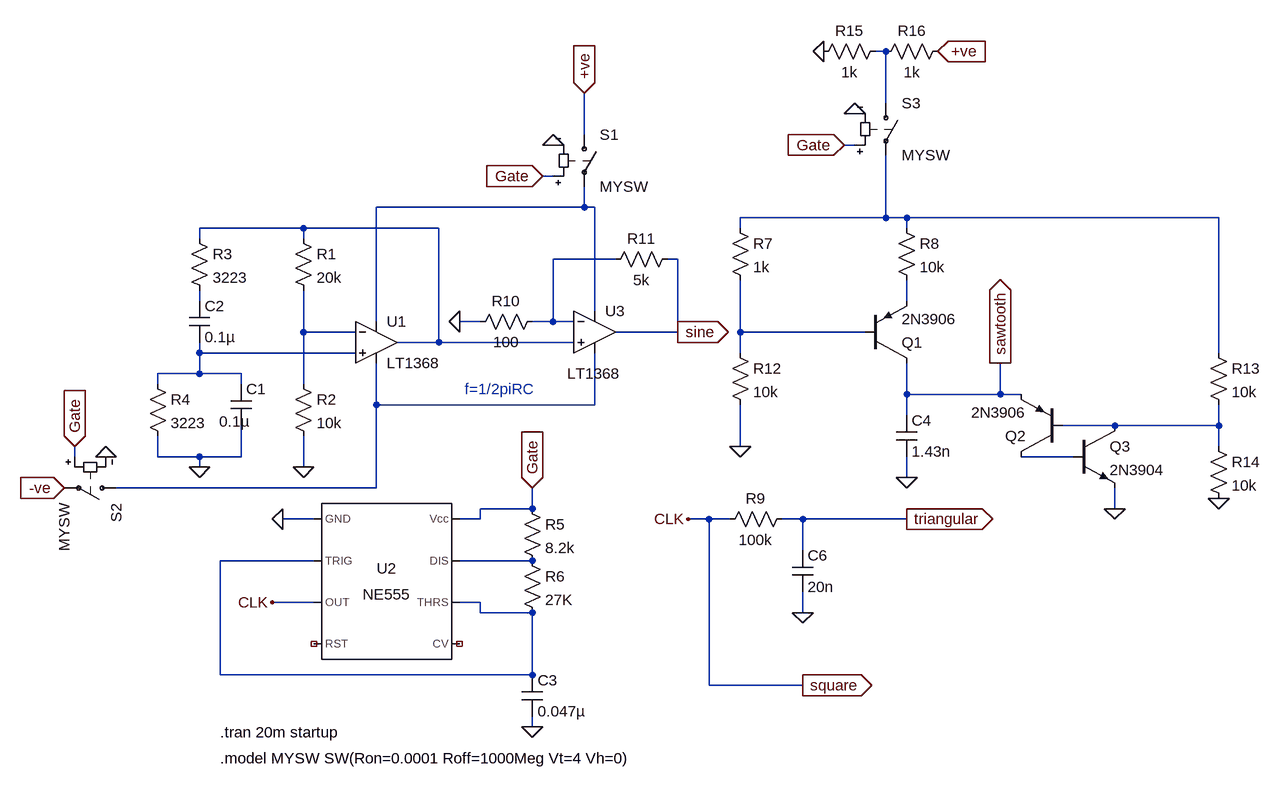
[diagram p0: schematic si.asc]
si.asc, the LTspice schematic file:
Version 4
SHEET 1 1908 792
WIRE 1328 -400 1312 -400
WIRE 1328 -320 1328 -400
WIRE 864 -272 864 -336
WIRE 1280 -256 1264 -256
WIRE 816 -208 800 -208
WIRE 864 -160 864 -192
WIRE 864 -160 544 -160
WIRE 880 -160 864 -160
WIRE 1328 -144 1328 -240
WIRE 1328 -144 1104 -144
WIRE 1360 -144 1328 -144
WIRE 1840 -144 1360 -144
WIRE 432 -128 272 -128
WIRE 640 -128 432 -128
WIRE 1104 -128 1104 -144
WIRE 1360 -128 1360 -144
WIRE 272 -112 272 -128
WIRE 432 -112 432 -128
WIRE 912 -80 816 -80
WIRE 1008 -80 992 -80
WIRE 272 -16 272 -32
WIRE 1360 -16 1360 -48
WIRE 880 0 880 -160
WIRE 544 16 544 -160
WIRE 704 16 672 16
WIRE 816 16 816 -80
WIRE 816 16 784 16
WIRE 848 16 816 16
WIRE 432 32 432 -32
WIRE 512 32 432 32
WIRE 1008 32 1008 -80
WIRE 1008 32 912 32
WIRE 1104 32 1104 -48
WIRE 1296 32 1104 32
WIRE 640 48 640 -128
WIRE 640 48 576 48
WIRE 848 48 640 48
WIRE 272 64 272 48
WIRE 512 64 272 64
WIRE 1104 64 1104 32
WIRE 1840 64 1840 -144
WIRE 272 96 272 64
WIRE 272 96 208 96
WIRE 336 96 272 96
WIRE 208 112 208 96
WIRE 336 112 336 96
WIRE 432 112 432 32
WIRE 1360 128 1360 80
WIRE 1504 128 1504 80
WIRE 1504 128 1360 128
WIRE 1536 128 1504 128
WIRE 544 144 544 80
WIRE 880 144 880 64
WIRE 880 144 544 144
WIRE 1360 160 1360 128
WIRE 1680 176 1600 176
WIRE 1840 176 1840 144
WIRE 1840 176 1680 176
WIRE 1104 208 1104 144
WIRE 1840 208 1840 176
WIRE 80 224 80 208
WIRE 208 224 208 192
WIRE 272 224 208 224
WIRE 336 224 336 176
WIRE 336 224 272 224
WIRE 1616 224 1536 224
WIRE 272 240 272 224
WIRE 432 240 432 192
WIRE 1360 256 1360 224
WIRE 544 272 544 144
WIRE 544 272 144 272
WIRE 784 304 784 272
WIRE 784 304 704 304
WIRE 1680 304 1680 272
WIRE 448 320 400 320
WIRE 704 320 704 304
WIRE 704 320 672 320
WIRE 1056 320 1024 320
WIRE 1088 320 1056 320
WIRE 1200 320 1168 320
WIRE 1360 320 1200 320
WIRE 1200 368 1200 320
WIRE 448 384 304 384
WIRE 784 384 672 384
WIRE 448 448 384 448
WIRE 704 448 672 448
WIRE 704 464 704 448
WIRE 784 464 704 464
WIRE 1200 464 1200 432
WIRE 304 560 304 384
WIRE 784 560 784 464
WIRE 784 560 304 560
WIRE 1056 576 1056 320
WIRE 1200 576 1056 576
WIRE 784 640 784 624
FLAG 432 240 0
FLAG 1008 32 sine
IOPIN 1008 32 Out
FLAG 384 448 CLK
FLAG 400 320 0
FLAG 1024 320 CLK
FLAG 1200 464 0
FLAG 1200 576 square
IOPIN 1200 576 Out
FLAG 1360 320 triangular
IOPIN 1360 320 Out
FLAG 672 16 0
FLAG 272 240 0
FLAG 784 272 Gate
IOPIN 784 272 In
FLAG 784 640 0
FLAG 1360 256 0
FLAG 1104 208 0
FLAG 1680 304 0
FLAG 1840 288 0
FLAG 1504 80 sawtooth
IOPIN 1504 80 Out
FLAG 864 -336 +ve
IOPIN 864 -336 In
FLAG 816 -256 0
FLAG 800 -208 Gate
IOPIN 800 -208 In
FLAG 64 272 -ve
IOPIN 64 272 In
FLAG 128 224 0
FLAG 80 208 Gate
IOPIN 80 208 In
FLAG 1408 -400 +ve
IOPIN 1408 -400 In
FLAG 1232 -400 0
FLAG 1280 -304 0
FLAG 1264 -256 Gate
IOPIN 1264 -256 In
SYMBOL res 416 -128 R0
SYMATTR InstName R1
SYMATTR Value 20k
SYMBOL res 416 96 R0
SYMATTR InstName R2
SYMATTR Value 10k
SYMBOL Opamps\\LT1368 544 -16 R0
SYMATTR InstName U1
SYMBOL Misc\\NE555 560 416 R0
SYMATTR InstName U2
SYMBOL res 1184 304 R90
WINDOW 0 0 56 VBottom 2
WINDOW 3 32 56 VTop 2
SYMATTR InstName R9
SYMATTR Value 100k
SYMBOL cap 1184 368 R0
SYMATTR InstName C6
SYMATTR Value 20n
SYMBOL Opamps\\LT1368 880 -32 R0
WINDOW 3 -42 128 Left 2
SYMATTR InstName U3
SYMBOL res 800 0 R90
WINDOW 0 0 56 VBottom 2
WINDOW 3 32 56 VTop 2
SYMATTR InstName R10
SYMATTR Value 100
SYMBOL res 1008 -96 R90
WINDOW 0 0 56 VBottom 2
WINDOW 3 32 56 VTop 2
SYMATTR InstName R11
SYMATTR Value 5k
SYMBOL cap 320 112 R0
WINDOW 3 -18 58 Left 2
SYMATTR Value 0.1µ
SYMATTR InstName C1
SYMBOL cap 256 -16 R0
SYMATTR InstName C2
SYMATTR Value 0.1µ
SYMBOL res 256 -128 R0
SYMATTR InstName R3
SYMATTR Value 3223
SYMBOL res 192 96 R0
SYMATTR InstName R4
SYMATTR Value 3223
SYMBOL res 768 288 R0
SYMATTR InstName R5
SYMATTR Value 8.2k
SYMBOL res 768 368 R0
SYMATTR InstName R6
SYMATTR Value 27K
SYMBOL cap 768 560 R0
SYMATTR InstName C3
SYMATTR Value 0.047µ
SYMBOL res 1088 -144 R0
SYMATTR InstName R7
SYMATTR Value 1k
SYMBOL res 1344 -144 R0
SYMATTR InstName R8
SYMATTR Value 10k
SYMBOL pnp 1296 80 M180
SYMATTR InstName Q1
SYMATTR Value 2N3906
SYMBOL res 1088 48 R0
SYMATTR InstName R12
SYMATTR Value 10k
SYMBOL pnp 1600 224 R180
SYMATTR InstName Q2
SYMATTR Value 2N3906
SYMBOL cap 1344 160 R0
SYMATTR InstName C4
SYMATTR Value 1.43n
SYMBOL npn 1616 176 R0
SYMATTR InstName Q3
SYMATTR Value 2N3904
SYMBOL res 1824 48 R0
SYMATTR InstName R13
SYMATTR Value 10k
SYMBOL res 1824 192 R0
SYMATTR InstName R14
SYMATTR Value 10k
SYMBOL sw 864 -288 R0
SYMATTR InstName S1
SYMATTR Value MYSW
SYMBOL sw 160 272 R90
SYMATTR InstName S2
SYMATTR Value MYSW
SYMBOL res 1328 -416 R90
WINDOW 0 0 56 VBottom 2
WINDOW 3 32 56 VTop 2
SYMATTR InstName R15
SYMATTR Value 1k
SYMBOL res 1424 -416 R90
WINDOW 0 0 56 VBottom 2
WINDOW 3 32 56 VTop 2
SYMATTR InstName R16
SYMATTR Value 1k
SYMBOL sw 1328 -336 R0
SYMATTR InstName S3
SYMATTR Value MYSW
TEXT 680 120 Left 2 ;f=1/2piRC
TEXT 304 648 Left 2 !.tran 20m startup
TEXT 304 688 Left 2 !.model MYSW SW(Ron=0.0001 Roff=1000Meg Vt=4 Vh=0)

The netlist it stands for:
* si.asc
R1 N004 N008 20k
R2 N008 0 10k
XU1 N010 N008 N002 N011 N004 LT1368  ; pins In+ In- V+ V- OUT
XU2 0 N014 square NC_01 NC_02 N014 N015 Gate NE555  ; pins GND TRIG OUT RST CV THRS DIS Vcc
R9 triangular square 100k
C6 triangular 0 20n
XU3 N004 N005 N002 N011 sine LT1368  ; pins In+ In- V+ V- OUT
R10 N005 0 100
R11 sine N005 5k
C1 N010 0 0.1µ
C2 N006 N010 0.1µ
R3 N004 N006 3223
R4 N010 0 3223
R5 Gate N015 8.2k
R6 N015 N014 27K
C3 N014 0 0.047µ
R7 N003 N009 1k
R8 N003 N007 10k
Q1 sawtooth N009 N007 0 2N3906
R12 N009 0 10k
Q2 N013 N012 sawtooth 0 2N3906
C4 sawtooth 0 1.43n
Q3 N012 N013 0 0 2N3904
R13 N003 N012 10k
R14 N012 0 10k
S1 +ve N002 Gate 0 MYSW
S2 N011 -ve Gate 0 MYSW
R15 N001 0 1k
R16 +ve N001 1k
S3 N001 N003 Gate 0 MYSW
.model NPN NPN
.model PNP PNP
.lib standard.bjt
* f=1/2piRC
.tran 20m startup
.model MYSW SW(Ron=0.0001 Roff=1000Meg Vt=4 Vh=0)
.lib NE555.sub
.backanno
.end